# Altium schematic sheet afficheur.SchDoc
size A4
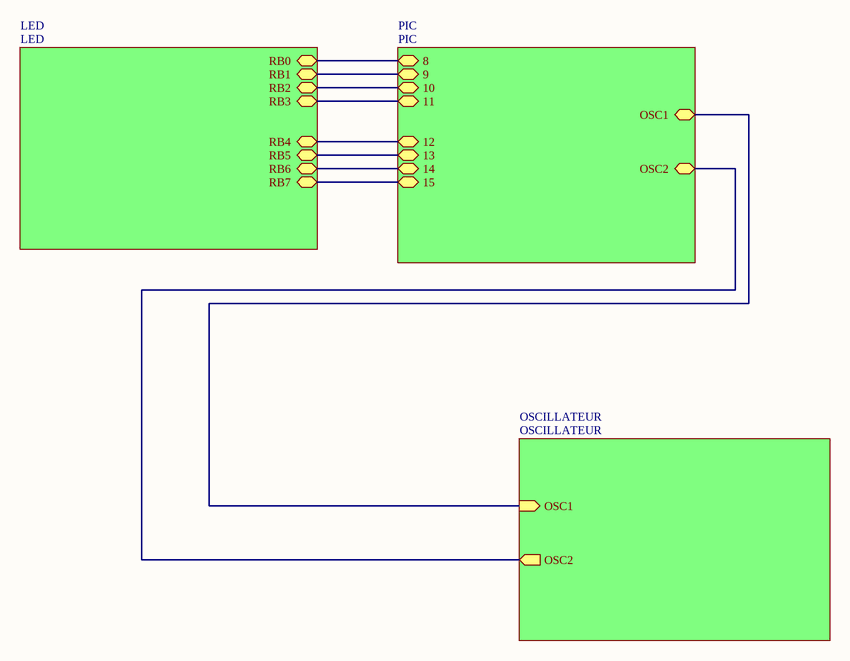
[diagram p0: afficheur.SchDoc]

## Sub-sheets
LED = LED: RB0, RB1, RB2, RB3, RB4, RB5, RB6, RB7
OSCILLATEUR = OSCILLATEUR: OSC1 (in), OSC2 (out)
PIC = PIC: 8, 9, 10, 11, 12, 13, 14, 15, OSC1, OSC2

## Nets
(unnamed): sheet LED/RB0, sheet PIC/8
(unnamed): sheet LED/RB1, sheet PIC/9
(unnamed): sheet LED/RB2, sheet PIC/10
(unnamed): sheet LED/RB3, sheet PIC/11
(unnamed): sheet LED/RB4, sheet PIC/12
(unnamed): sheet LED/RB5, sheet PIC/13
(unnamed): sheet LED/RB6, sheet PIC/14
(unnamed): sheet LED/RB7, sheet PIC/15
(unnamed): sheet OSCILLATEUR/OSC1, sheet PIC/OSC1
(unnamed): sheet OSCILLATEUR/OSC2, sheet PIC/OSC2